# Altium project P22296-1.PrjPcb (part 3 of 3)

## Sheet Power2.SchDoc: Titel
size A3; ApprovedBy: name; CompanyName: DCI Electronics bv; DrawnBy: KRS; Address1: Nijverheidsstraat 14; Address2: 4458 AV Eindewege; Address3: Phone: +31 (0)113 344880; DocumentNumber: 7; Revision: 1; SheetNumber: 7; SheetTotal: 14; PageSetup: Record=PageOptions|CenterHorizontal=True|CenterVertical=True|PrintScale=1.00|XCorrection=1.00|YCorrection=1.00|PrintKind=1|BorderSize=5000000|LeftOffset=0|BottomOffset=0|Orientation=2|PaperLength=1000|PaperWidth=1000|Scale=100|PaperSource=7|PrintQuality=-4|MediaType=1|DitherType=10|PaperKind=ISO_A4_(210.00_x_297.00_MM)|PrintScaleMode=1; SubTitle: SubTitel; ApprovedDate: 01-01-12; DesignedBy: KRS
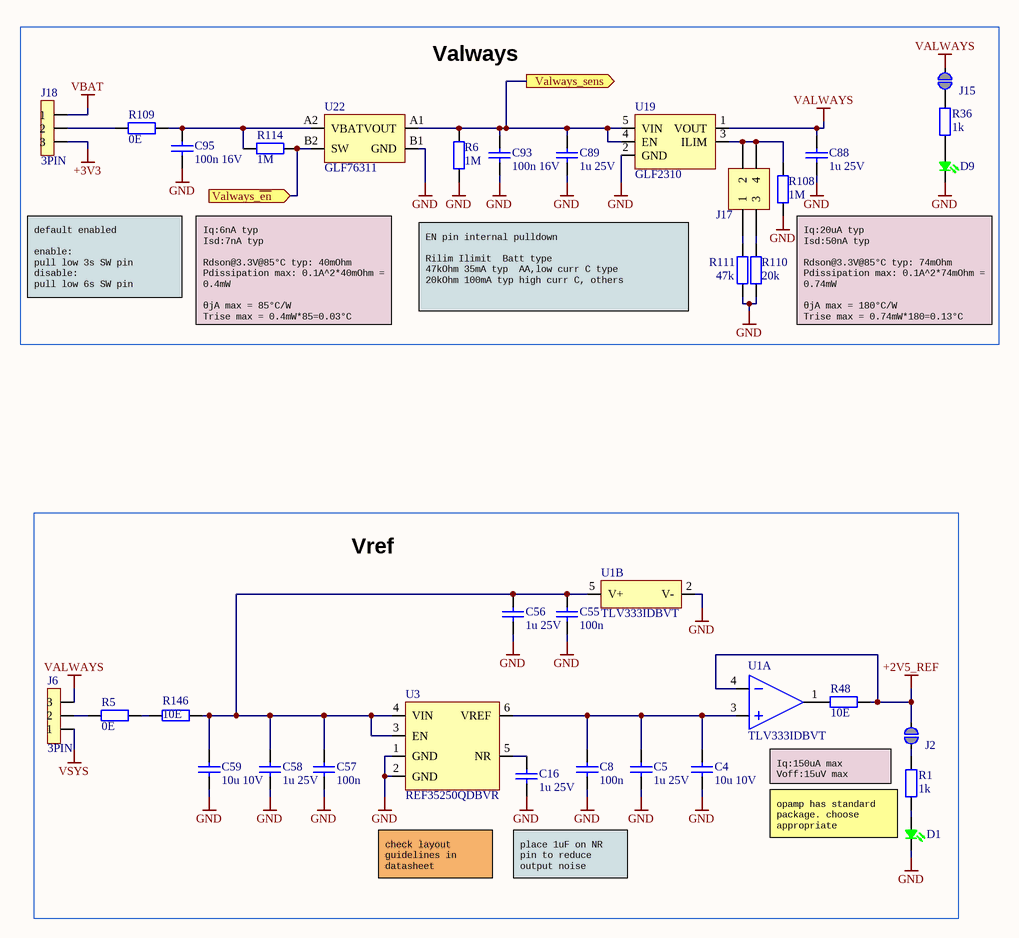
[diagram p13: Power2.SchDoc]

### Parts
C4  10u 10V  [CAPC1608X09N]
C5  1u 25V  [CAPC1608X09N]
C8  100n  [CAPC1608X09N]
C16  1u 25V  [CAPC1608X09N]
C55  100n  [CAPC1608X09N]
C56  1u 25V  [CAPC1608X09N]
C57  100n  [CAPC1608X09N]
C58  1u 25V  [CAPC1608X09N]
C59  10u 10V  [CAPC1608X09N]
C88  1u 25V  [CAPC1608X09N]
C89  1u 25V  [CAPC1608X09N]
C93  100n 16V  [CAPC1005X05N]
C95  100n 16V  [CAPC1005X05N]
D1  (no value)  [LED_0603_ANODE]
D9  (no value)  [LED_0603_ANODE]
J2  Solderbridge - Normally Open  [Solderbridge NO]  (value not drawn)  (no BOM)
J6  3PIN  [CON-003G001-003]
J15  Solderbridge - Normally Open  [Solderbridge NO]  (value not drawn)  (no BOM)
J17  2X2PIN  [CON-003G000-004]  (value not drawn)
J18  3PIN  [CON-003G001-003]
R1  1k  [RESC1608X13N]
R5  0E  [RESC1005X04N]
R6  1M  [RESC1005x04N]
R36  1k  [RESC1608X13N]
R48  10E  [RESC1608X13N]
R108  1M  [RESC1005x04N]
R109  0E  [RESC1005X04N]
R110  20k  [RESC1608X13N]
R111  47k  [RESC1608X13N]
R114  1M  [RESC1005x04N]
R146  10E  [RESC1608X13N]
U1  TLV333IDBVT  [SOT95P300X145-5N]  (parts A,B of 2)
U3  REF35250QDBVR  [SOT95P300X145-6N]
U19  GLF2310  [SOT95P280X115-5N]
U22  GLF76311  [BGA4C50P2X2_97X97X55]

### Blocks framed on the sheet
Valways: C88 C89 C93 C95 D9 J15 J17 J18 R6 R36 R108-R111 R114 U19 U22
Vref: C4 C5 C8 C16 C55-C59 D1 J2 J6 R1 R5 R48 R146 U1 U3

### Ports
Valways_sens (out), Valways_~{en} (in)

### Nets
+2V5_REF: J2.2 R48.2 U1.4(IN-)
+3V3: J18.3
GND: C4.1 C5.1 C8.1 C16.1 C55.1 C56.1 C57.1 C58.1 C59.1 C88.1 C89.1 C93.1 C95.1 D1.C D9.C R6.2 R108.1 R110.1 R111.1 U1.2(V-) U3.1(GND) U3.2(GND) U19.2(GND) U22.B1(GND)
VALWAYS: C88.2 J6.3 J15.2 U19.1(VOUT)
VBAT: J18.1
VSYS: J6.1
Valways_~{en}: R114.1 U22.B2(SW) ; port Valways_~{en}
Valways_sens: C89.2 C93.2 R6.1 U19.4(EN) U19.5(VIN) U22.A1(VOUT) ; port Valways_sens
NetC4_2: C4.2 C5.2 C8.2 U1.3(IN+) U3.6(VREF)
NetC16_2: C16.2 U3.5(NR)
NetC55_2: C55.2 C56.2 C57.2 C58.2 C59.2 R146.2 U1.5(V+) U3.3(EN) U3.4(VIN)
NetC95_2: C95.2 R109.2 R114.2 U22.A2(VBAT)
NetD1_A: D1.A R1.2
NetD9_A: D9.A R36.2
NetJ2_1: J2.1 R1.1
NetJ6_2: J6.2 R5.1
NetJ15_1: J15.1 R36.1
NetJ17_1: J17.1 R111.2
NetJ17_2: J17.2 J17.4 R108.2 U19.3(ILIM)
NetJ17_3: J17.3 R110.2
NetJ18_2: J18.2 R109.1
NetR5_2: R5.2 R146.1
NetR48_1: R48.1 U1.1(OUT)

### Notes on the sheet
- default enabled
  enable:
  pull low 3s SW pin
  disable:
  pull low 6s SW pin
- Iq:6nA typ
  Isd:7nA typ
  Rdson@3.3V@85°C typ: 40mOhm
  Pdissipation max: 0.1A^2*40mOhm = 0.4mW
  θjA max = 85°C/W
  Trise max = 0.4mW*85=0.03°C
- EN pin internal pulldown
  Rilim	Ilimit		Batt type
  47kOhm	35mA typ		AA,low curr C type
  20kOhm	100mA typ	high curr C, others
- (near R108) Iq:20uA typ
  Isd:50nA typ
  Rdson@3.3V@85°C typ: 74mOhm
  Pdissipation max: 0.1A^2*74mOhm = 0.74mW
  θjA max = 180°C/W
  Trise max = 0.74mW*180=0.13°C
- Iq:150uA max
  Voff:15uV max
- opamp has standard package. choose appropriate
- check layout guidelines in datasheet
- place 1uF on NR pin to reduce output noise
- Designed by:
- Drawing number:
- Variant:
- Date:
- Page:
- Rev:
- Of:
- Dekimo Goes B.V.
- Nijverheidsstraat 14, 4458 AV  Eindewege, Phone: +31 (0)113 344880

### Library data of the parts
C4 C59 = CKE 10UV10/60: 10uF 10V ±20% X7T; EngPartGrpMainCode: CAP; ManufactpartCode: GRM188D71A106MA73D-MUR; Type: Capacitor ceramic SMD; Preferred: False; SMD_Flag: True; PartCode: CKE 10UV10/60
C5 C16 C56 C58 C88 C89 = CKE 1U/61: 1UF, 25V, 10%, 0603, X7R; EngPartGrpMainCode: CAP; ManufactpartCode: CL10B105KA8NNNC-SAM; Type: Capacitor ceramic SMD; Preferred: False; SMD_Flag: True; PartCode: CKE 1U/61
C8 C55 C57 = CKE 100N/60: 100nF 50V 10% X7R; EngPartGrpMainCode: CAP; ManufactpartCode: 2238 586 15649-PHI; Type: Capacitor ceramic SMD; Preferred: False; SMD_Flag: True; PartCode: CKE 100N/60
C93 C95 = CKE 100N/70: 100nF, 16V, 10%, X7R; EngPartGrpMainCode: CAP; ManufactpartCode: CC0402KRX7R7BB104-YAG; Type: Capacitor ceramic SMD; Preferred: False; SMD_Flag: True; PartCode: CKE 100N/70
D1 D9 = LED SMDG/16: Led Groen 0603; EngPartGrpMainCode: OPTO; ManufactpartCode: 150060VS75003-WE; Type: LED SMD; Preferred: False; SMD_Flag: True; PartCode: LED SMDG/16
J2 J15 = SolderbridgeNO: Solderbridge  - Normally Open
J6 J18 = CON PHDR1X3S/11: pinh 1x3/straight/Au/1.27pitch; EngPartGrpMainCode: CONN; ManufactpartCode: M50-3630342-HAR; Preferred: False; SMD_Flag: True; PartCode: CON PHDR1X3S/11; Type: Connector pinhdr SMD
J17 = CON PHDR2X2S/11: pinh 2x2/straight/Au/1.27pitch; EngPartGrpMainCode: CONN; ManufactpartCode: GRPB022VWQS-RC-SUL; Preferred: False; SMD_Flag: True; PartCode: CON PHDR2X2S/11; Type: Connector pinhdr SMD
R1 R36 = R 1K/60: 1K, 100mW, 1%; PartCode: R 1K/60; EngPartGrpMainCode: RES; ManufactpartCode: RC0603FR-071KL-YAG; Preferred: True; Type: Resistor metalfilm SMD; SMD_Flag: True
R5 R109 = R 0E/70: 0E, 62.5mW, 1%; PartCode: R 0E/70; EngPartGrpMainCode: RES; ManufactpartCode: RC0402JR-070RL-YAG; Preferred: False; SMD_Flag: True; Type: Resistor metalfilm SMD
R6 R108 R114 = R 1M/70: 1M, 62.5mW, 1%; PartCode: R 1M/70; EngPartGrpMainCode: RES; ManufactpartCode: RC0402FR-071ML-YAG; Preferred: False; SMD_Flag: True; Type: Resistor metalfilm SMD
R48 R146 = R 10E/60: 10E 0.1W 1%; EngPartGrpMainCode: RES; ManufactpartCode: RC0603FR-0710RL-YAG; Preferred: False; SMD_Flag: True; PartCode: R 10E/60; Type: Resistor metalfilm SMD
R110 = R 20K/60: 20k 100mW, 1%; EngPartGrpMainCode: RES; ManufactpartCode: RC0603FR-0720KL-YAG; Preferred: False; SMD_Flag: True; PartCode: R 20K/60; Type: Resistor metalfilm SMD
R111 = R 47K/60: 47k 100mW 1%; EngPartGrpMainCode: RES; ManufactpartCode: RC0603FR-0747KL-YAG; Preferred: False; SMD_Flag: True; PartCode: R 47K/60; Type: Resistor metalfilm SMD
U1 = IC TLV333/SOT: Op-Amp zero drift; EngPartGrpMainCode: IC; ManufactpartCode: TLV333IDBVT-TI; Preferred: False; SMD_Flag: True; PartCode: IC TLV333/SOT; Type: IC OpAmp SMD
U3 = IC REF35250QDBV: REF35250QDBVR, 2,5V; EngPartGrpMainCode: IC; ManufactpartCode: REF35250QDBVR-TI; Preferred: False; SMD_Flag: True; PartCode: IC REF35250QDBV; Type: IC voltage reference SMD
U19 = IC GLF2310A-T1: load sw adj current limit 5.5V; EngPartGrpMainCode: IC; ManufactpartCode: GLF2310A-T1G7-GLF; Preferred: False; SMD_Flag: True; PartCode: IC GLF2310A-T1; Type: IC switch SMD
U22 = IC GLF76311: Smart load sw, 2A, 5.5V; EngPartGrpMainCode: IC; ManufactpartCode: GLF76311-GLF; Preferred: False; SMD_Flag: True; PartCode: IC GLF76311; Type: IC switch SMD

## Nets that join several sheets
+2V5_REF: Sensor (J9.B7), SensorSlot1 (J4.A8 J4.B8), SensorSlot2 (J8.A8 J8.B8), Power2 (J2.2 R48.2 U1.4)
+3V3: MCU (R65.2), Power1 (15 pins), Power2 (J18.3)
GND: MCU (39 pins), MCU_RF (29 pins), Sensor (41 pins), SensorSlot1 (39 pins), SensorSlot2 (39 pins), BatteryMonitor (13 pins), Memory (10 pins), RTC (11 pins), USB (16 pins), Power1 (45 pins), Power2 (24 pins)
V_LOW_POWER: MCU (J27.2), RTC (5 pins), Power1 (J14.2 R95.2 R96.1)
VALWAYS: Sensor (J9.A8), SensorSlot1 (J4.B4), SensorSlot2 (J8.B4), Power2 (C88.2 J6.3 J15.2 U19.1)
VBAT: MCU (J11.1 J19.8), BatteryMonitor (5 pins), RTC (R20.1 R145.2), Power1 (6 pins), Power2 (J18.1)
VBUS: MCU (R18.1), Sensor (J9.A1 J9.A2 J9.B1 J9.B2), SensorSlot1 (J4.A1 J4.A2 J4.B1 J4.B2), SensorSlot2 (J8.A1 J8.A2 J8.B1 J8.B2), Power1 (C26.2 D13.A)
VCC: MCU (6 pins), BatteryMonitor (C45.2 R99.1 R101.2), RTC (R30.1), Power1 (9 pins)
VCC_MCU: MCU (15 pins), MCU_RF (L5.2), RTC (R80.2), Power1 (R52.1)
VSENSOR: Sensor (J9.A5 J9.B5), SensorSlot1 (6 pins), SensorSlot2 (6 pins), Power1 (C80.2 J7.2 U17.1)
VSYS: MCU (R13.2 R15.2), Sensor (15 pins), Memory (18 pins), Power1 (C91.2 J23.2 U20.1), Power2 (J6.1)
VUSB: USB (9 pins), Power1 (J24.2)
~{RTC_PWR_EN}: MCU (U14.20), RTC (R23.2 R24.1 R81.2 TS38.1), Power1 (D31.C D32.C R144.1 T20.G)
BAT_~{ALERT}: MCU (U14.13), BatteryMonitor (R62.1 T2.D), RTC (D30.C TS9.1)
BOX_OPEN: MCU (R79.2 T1.2 U5.43), RTC (C74.2 R27.2 TS30.1 U10.2)
FE_CTRL2: MCU (U5.38), MCU_RF (R3.2)
FE_CTRL3: MCU (TS16.1 U5.2), MCU_RF (R4.2)
FLASH_NOR_~{CS}: MCU (U14.6), Memory (R125.1 TS48.1 U24.1)
FLASH_SD_~{CS}: MCU (U14.5), Memory (D33.4 J21.2 R120.1 TS49.1)
FRAM_~{CS}: MCU (U14.4), Memory (R129.1 TS50.1 U23.1)
GE_EN: MCU (U14.7), BatteryMonitor (R100.2 R101.1 TS37.1 U18.5)
I2C_bus.SCL: MCU (R15.1 R133.1 TS5.1), Sensor (U8.5 U15.22), SensorSlot1 (U13.5), SensorSlot2 (U7.5)
I2C_bus.SDA: MCU (R13.1 R132.1 TS4.1), Sensor (U8.4 U15.23), SensorSlot1 (U13.4), SensorSlot2 (U7.4)
I2C_sys.SCL: MCU (5 pins), BatteryMonitor (R91.2), RTC (U10.7)
I2C_sys.SDA: MCU (5 pins), BatteryMonitor (R92.2), RTC (U10.6)
INT1: Sensor (R59.2 T11.G), SensorSlot1 (6 pins)
INT2: Sensor (R60.2 T12.G), SensorSlot2 (6 pins)
LOADSW1: Sensor (U15.4), SensorSlot1 (R22.2 U9.4)
LOADSW2: Sensor (U15.5), SensorSlot2 (R28.2 U16.4)
MCU_IRQ~{detect}: MCU (U5.1), RTC (R80.1 TS28.1 U10.11)
MCU_~{RST}: MCU (5 pins), RTC (R84.1 R88.1 TS34.1 U10.1)
RSVD.0: Sensor (J9.A10), SensorSlot1 (J4.A13), SensorSlot2 (J8.A13)
RSVD.1: Sensor (J9.B10), SensorSlot1 (J4.A15), SensorSlot2 (J8.A15)
RSVD.2: Sensor (J9.A11), SensorSlot1 (J4.B13), SensorSlot2 (J8.B13)
RSVD.3: Sensor (J9.B11), SensorSlot1 (J4.B15), SensorSlot2 (J8.B15)
RTC_EXT_~{IRQ}: Sensor (6 pins), RTC (7 pins)
SC_EN: MCU (U14.19), Power1 (R153.2 T21.G TS19.1)
SENSOR_INTx: MCU (U14.11), Sensor (R83.1 U15.1)
SHARED_GPIO.GPIO1: Sensor (J9.B19), SensorSlot1 (J4.A25), SensorSlot2 (J8.A25)
SHARED_GPIO.GPIO2: Sensor (J9.A19), SensorSlot1 (J4.A27), SensorSlot2 (J8.A27)
SHARED_GPIO.GPIO3: Sensor (J9.B21), SensorSlot1 (J4.A29), SensorSlot2 (J8.A29)
SHARED_GPIO.GPIO4: Sensor (J9.A21), SensorSlot1 (J4.A31), SensorSlot2 (J8.A31)
SHARED_GPIO.GPIO5: Sensor (J9.B23), SensorSlot1 (J4.B29), SensorSlot2 (J8.B29)
SHARED_GPIO.GPIO6: Sensor (J9.A23), SensorSlot1 (J4.B30), SensorSlot2 (J8.B30)
SHARED_GPIO.GPIO7: Sensor (J9.B25), SensorSlot1 (J4.B31), SensorSlot2 (J8.B31)
SHARED_GPIO.GPIO8: Sensor (J9.A25), SensorSlot1 (J4.B32), SensorSlot2 (J8.B32)
SLOT1_GPIO0: Sensor (R147.2), SensorSlot1 (J4.B10)
SLOT1_GPIO1: Sensor (R148.2), SensorSlot1 (J4.A10)
SLOT1_GPIO2: Sensor (R149.2), SensorSlot1 (J4.B11)
SLOT2_GPIO0: Sensor (R150.2), SensorSlot2 (J8.B10)
SLOT2_GPIO1: Sensor (R151.2), SensorSlot2 (J8.A10)
SLOT2_GPIO2: Sensor (R152.2), SensorSlot2 (J8.B11)
SPI_sys.MISO: MCU (R54.1 TS22.1), Memory (5 pins)
SPI_sys.MOSI: MCU (R56.1 TS20.1), Memory (5 pins)
SPI_sys.SCK: MCU (R55.1 TS25.1), Memory (5 pins)
USART2.CTS: MCU (R16.1 TS47.1), USB (U12.24)
USART2.RTS: MCU (R17.1 TS44.1), USB (U12.23)
USART2.RX: MCU (R11.1 TS42.1), USB (U12.26)
USART2.TX: MCU (R12.1 TS43.1), USB (U12.25)
USB_connected: MCU (U14.10), RTC (R154.2 T22.G TS1.1), USB (NT1.1)
Valways_~{en}: MCU (U14.16), Power2 (R114.1 U22.B2)
Valways_sens: MCU (U14.8), Power2 (6 pins)
Vsensor_en: MCU (U14.14), Power1 (U17.4)
Vsys_en: MCU (U14.15), Power1 (R105.2 U20.4)

## Assembly variants
Full_version: not fitted C1 C2 C12 C12 C13 C21 C26 C65 C72 D7 D8 D27 D34 J10 R1 R9 R10 R14 R26 R27 R30 R36 R58 R66 R67 R81 R84 R96 R115 R144 R153 T9 T10 T20 T21
Standaard: not fitted C1 C2 C4 C5 C8 C12 C13 C16 C21 C26 C38 C55 C56 C57 C58 C59 C65 C72 C88 C89 C93 C95 C100 C102 D1 D7 D8 D9 D27 D33 D34 J2 J6 J10 J15 J17 J18 J21 L1 R1 R1 R5 R6 R9 R26 R27 R30 R36 R36 R48 R58 R66 R67 R79 R81 R84 R96 R108 R109 R110 R111 R114 R115 R120 R126 R144 R146 R153 S3 T1 T9 T10 T20 T21 U1 U3 U19 U22
FOTA: not fitted C1 C2 C4 C5 C8 C12 C13 C16 C21 C26 C55 C56 C57 C58 C59 C65 C72 C88 C89 C93 C95 D1 D7 D8 D9 D27 D34 J2 J6 J10 J15 J17 J18 R1 R1 R5 R6 R9 R10 R14 R26 R27 R30 R36 R36 R48 R58 R66 R67 R81 R84 R96 R108 R109 R110 R111 R114 R115 R144 R146 R153 T9 T10 T20 T21 U1 U3 U19 U22